# EAGLE design Topshell_V1.2 (EAGLE 7.7.0)
CREVISION: V1.2; DESIGNER: Charlie Costakis
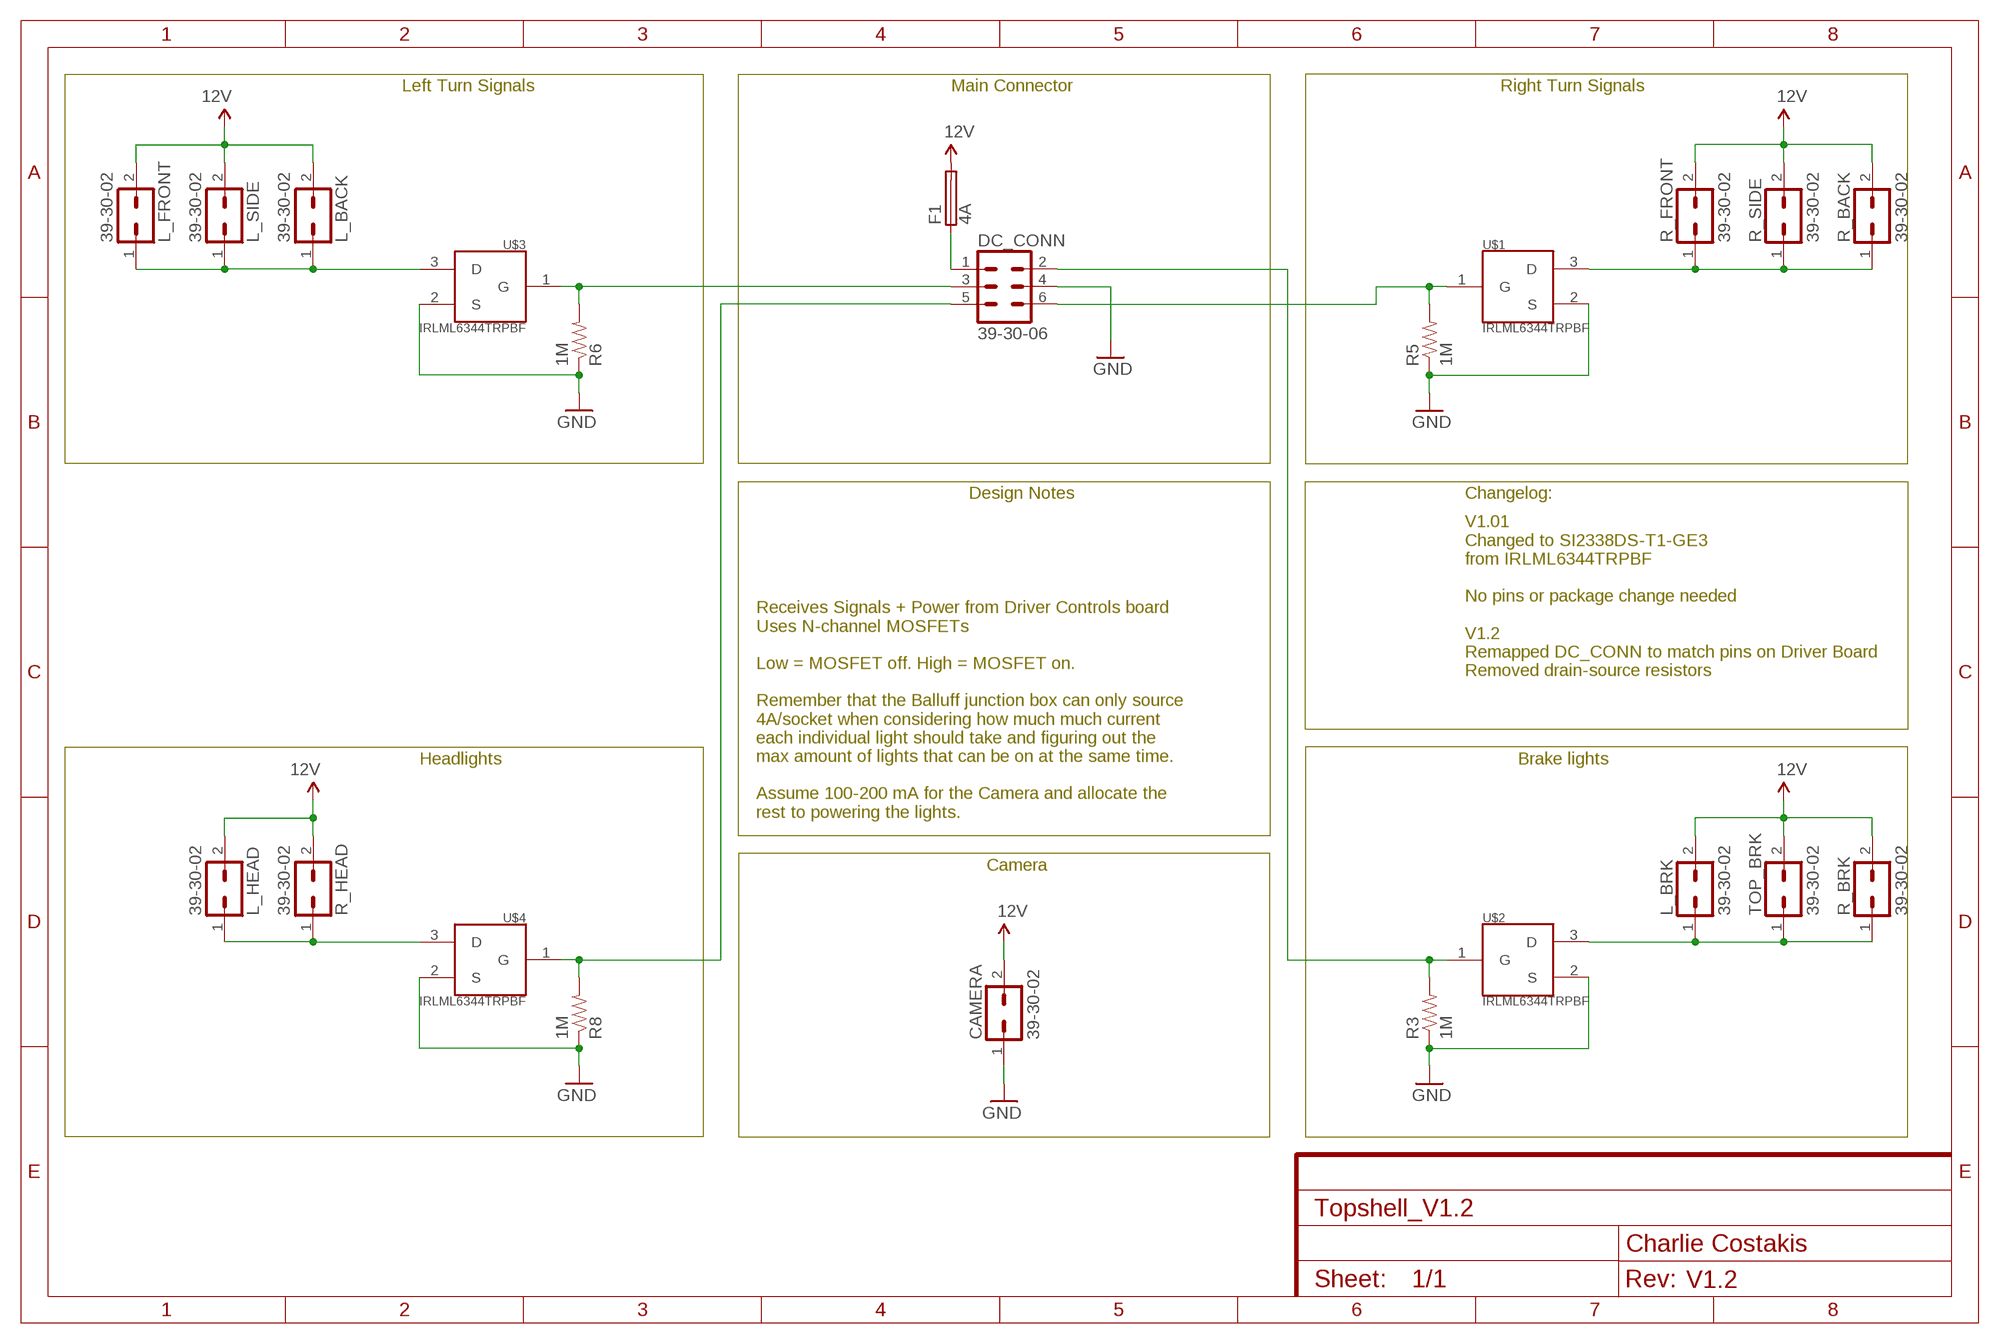
[diagram p0: schematic, sheet 1]

## Parts
CAMERA  39-30-02  [39-30-?02?]
DC_CONN  39-30-06  [39-30-?06?]
F1  4A  SMD-MICRO-FUSE-BLOCK  [OMNIBLOK]
L_BACK  39-30-02  [39-30-?02?]
L_BRK  39-30-02  [39-30-?02?]
L_FRONT  39-30-02  [39-30-?02?]
L_HEAD  39-30-02  [39-30-?02?]
L_SIDE  39-30-02  [39-30-?02?]
R3  1M  RESISTOR0805-RES  [0805]
R5  1M  RESISTOR0805-RES  [0805]
R6  1M  RESISTOR0805-RES  [0805]
R8  1M  RESISTOR0805-RES  [0805]
R_BACK  39-30-02  [39-30-?02?]
R_BRK  39-30-02  [39-30-?02?]
R_FRONT  39-30-02  [39-30-?02?]
R_HEAD  39-30-02  [39-30-?02?]
R_SIDE  39-30-02  [39-30-?02?]
TOP_BRK  39-30-02  [39-30-?02?]
U$1  IRLML6344TRPBF  [SOT23]
U$2  IRLML6344TRPBF  [SOT23]
U$3  IRLML6344TRPBF  [SOT23]
U$4  IRLML6344TRPBF  [SOT23]

## Nets
12V: CAMERA.2 F1.P$2 L_BACK.2 L_BRK.2 L_FRONT.2 L_HEAD.2 L_SIDE.2 R_BACK.2 R_BRK.2 R_FRONT.2 R_HEAD.2 R_SIDE.2 TOP_BRK.2
GND: CAMERA.1 DC_CONN.4 R3.1 R5.1 R6.1 R8.1 U$1.2(S) U$2.2(S) U$3.2(S) U$4.2(S)
N$1: DC_CONN.6 R5.2 U$1.1(G)
N$2: R_BACK.1 R_FRONT.1 R_SIDE.1 U$1.3(D)
N$3: DC_CONN.2 R3.2 U$2.1(G)
N$4: L_BRK.1 R_BRK.1 TOP_BRK.1 U$2.3(D)
N$5: DC_CONN.3 R6.2 U$3.1(G)
N$6: L_BACK.1 L_FRONT.1 L_SIDE.1 U$3.3(D)
N$7: DC_CONN.5 R8.2 U$4.1(G)
N$8: L_HEAD.1 R_HEAD.1 U$4.3(D)
N$14: DC_CONN.1 F1.P$1

## Notes on the sheet
- Left Turn Signals | Main Connector | Right Turn Signals
- Design Notes | Changelog:
- V1.01
  Changed to SI2338DS-T1-GE3
  from IRLML6344TRPBF 
  
  No pins or package change needed
  
  V1.2
  Remapped DC_CONN to match pins on Driver Board
  Removed drain-source resistors
- Headlights | Brake lights
- Receives Signals + Power from Driver Controls board
  Uses N-channel MOSFETs
  
  Low = MOSFET off. High = MOSFET on.
  
  Remember that the Balluff junction box can only source
  4A/socket when considering how much much current
  each individual light should take and figuring out the 
  max amount of lights that can be on at the same time.
  
  Assume 100-200 mA for the Camera and allocate the 
  rest to powering the lights.
- Camera

## Library data of the parts
CAMERA L_BACK L_BRK L_FRONT L_HEAD L_SIDE R_BACK R_BRK R_FRONT R_HEAD R_SIDE TOP_BRK = con-molex-mini-fit:39-30-?02?: HEADER
DC_CONN = con-molex-mini-fit:39-30-?06?: HEADER
F1 = f-lf-omniblok-s:SMD-MICRO-FUSE
R3 R5 R6 R8 = SparkFun-Resistors:RESISTOR: Resistor Basic schematic elements and footprints for 0603, 1206, and PTH resistors.
U$1-U$4 = NUSOLAR_Custom:IRLML6344TRPBF

## Net classes
0 default: clearance 0.205 mm

## Board
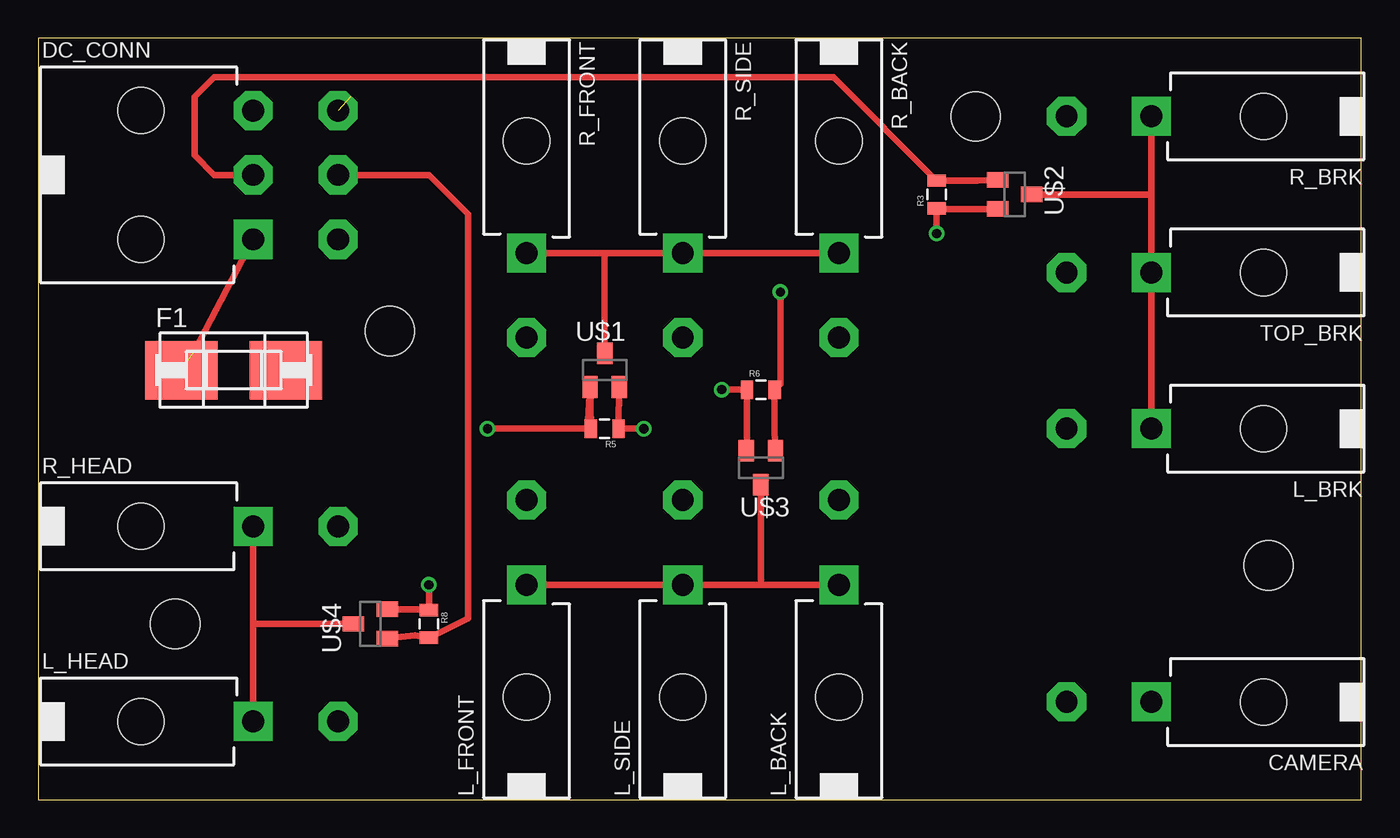
[diagram p1: board, top side]
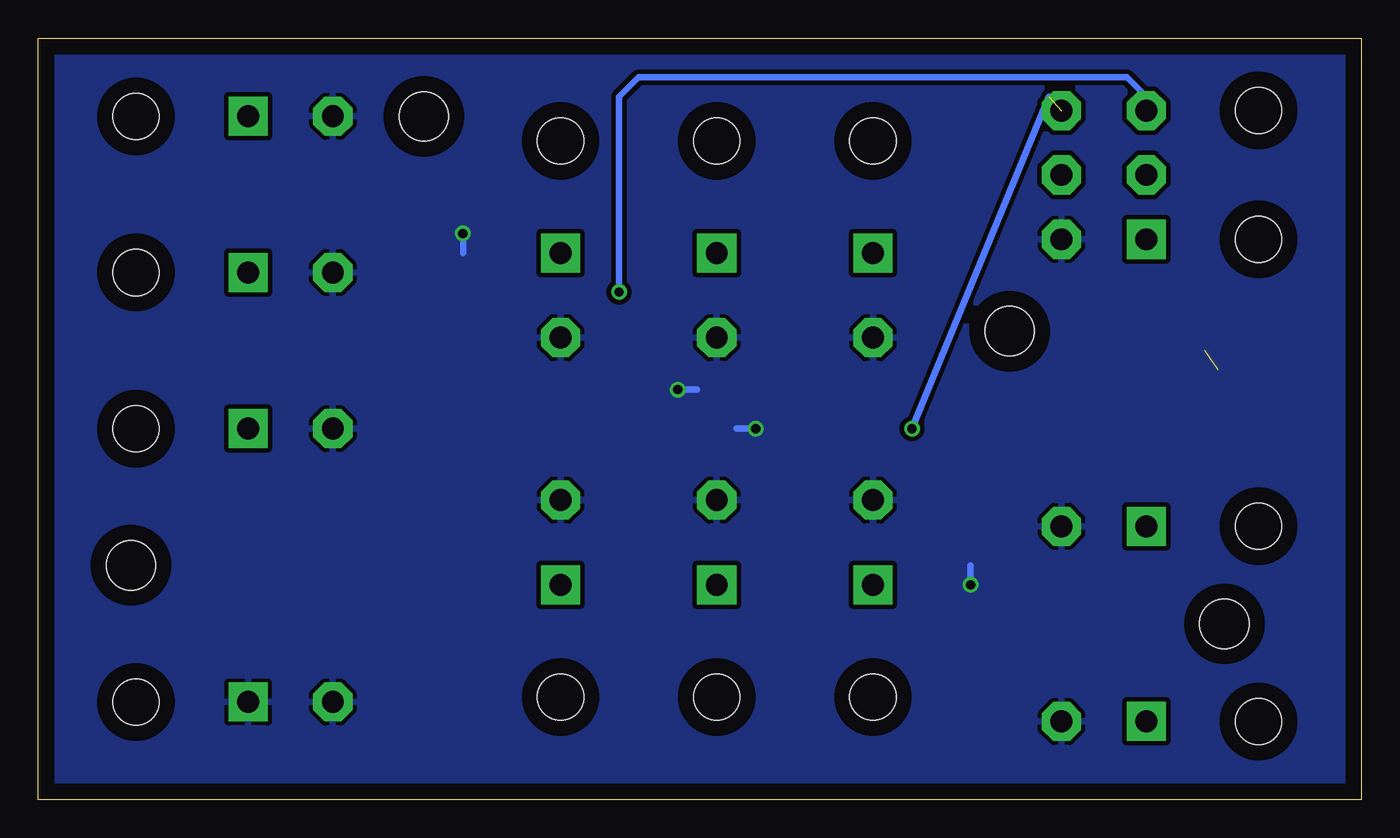
[diagram p2: board, bottom side, seen from below]

Size 86.03 x 49.52 mm. Coordinates in mm from the lower left corner, seen from the top.
Outline: 0,0 86.03,0 86.03,49.52 0,49.52 0,0
Copper layers (1*16): Top 0.035mm / dielectric 1.5mm / Bottom 0.035mm
Design rules "default *": minimum track width 10mil, minimum drill 10mil, track to track 8mil, track to pad 8mil, pad to pad 8mil, via to via 8mil, smd to smd 8mil, copper to edge 40mil, drill to drill 8mil, minimum pad ring 10mil, minimum via ring 8mil, stop-mask expansion 4mil, vias tented up to drill 0mil, thermal gap 10mil
Holes 3.2 mm at 80.01,15.24 8.89,11.43 60.96,44.45 22.86,30.48

### Footprints (pad centres in the part's own frame; a part is rotated, then mirrored left to right if it is on the bottom)
39-30-?02? = drill 1.422 pad 2.54 square: 1 0,0 | drill 1.422 pad 2.54 octagon: 2 0,5.512 | hole 3: 0,-7.3
39-30-?06? = drill 1.422 pad 2.54 square: 1 4.191,0 | drill 1.422 pad 2.54 octagon: 2 0,0; 3 -4.191,0; 4 4.191,5.512; 5 0,5.512; 6 -4.191,5.512 | hole 3: -4.191,-7.3; 4.191,-7.3
OMNIBLOK = smd 4.7 x 3.8: P$1 -3.4,0; P$2 3.4,0
0805 = smd 0.8 x 1.2: 1 -0.9,0; 2 0.9,0
SOT23 = smd 1 x 1.4: 1 -0.95,-1.1; 2 0.95,-1.1; 3 0,1.1

### Placement (x,y rotation side)
CAMERA  39-30-02?  [39-30-?02?]  72.39,6.35 90 top
DC_CONN  39-30-06?  [39-30-?06?]  13.97,40.64 270 top
F1  12.7,27.94 0 top
L_BACK  39-30-02?  [39-30-?02?]  52.07,13.97 0 top
L_BRK  39-30-02?  [39-30-?02?]  72.39,24.13 90 top
L_FRONT  39-30-02?  [39-30-?02?]  31.75,13.97 0 top
L_HEAD  39-30-02?  [39-30-?02?]  13.97,5.08 270 top
L_SIDE  39-30-02?  [39-30-?02?]  41.91,13.97 0 top
R3  58.42,39.37 90 top
R5  36.83,24.13 180 top
R6  46.99,26.67 0 top
R8  25.4,11.43 270 top
R_BACK  39-30-02?  [39-30-?02?]  52.07,35.56 180 top
R_BRK  39-30-02?  [39-30-?02?]  72.39,44.45 90 top
R_FRONT  39-30-02?  [39-30-?02?]  31.75,35.56 180 top
R_HEAD  39-30-02?  [39-30-?02?]  13.97,17.78 270 top
R_SIDE  39-30-02?  [39-30-?02?]  41.91,35.56 180 top
TOP_BRK  39-30-02?  [39-30-?02?]  72.39,34.29 90 top
U$1  36.83,27.94 0 top
U$2  63.5,39.37 270 top
U$3  46.99,21.59 180 top
U$4  21.59,11.43 90 top

### Tracks (layer width: path | path; a pad name or v marks a point on that pad's centre or on a via)
12V
  pour Bottom (isolate 0.305): 0,48.26 85.09,48.26 85.09,1.27 0,1.27
GND  (via drill 0.6)
  Top 0.406: v58.42,36.83 R3.1 58.42,38.42 U$2.2 | v44.45,26.67 R6.1 46.09,22.69 U$3.2 | v39.37,24.13 R5.1 37.73,24.3 U$1.2 | v25.4,13.97 R8.1 25.4,12.38 U$4.2
  Bottom 0.406: v58.42,36.83 58.42,35.56 | v44.45,26.67 43.18,26.67 | v39.37,24.13 40.64,24.13 | v25.4,13.97 25.4,15.24
  pour Bottom (isolate 0.305): 1.27,48.26 85.09,48.26 85.09,1.27 1.27,1.27
N$1  (via drill 0.6)  (1 unrouted)
  Top 0.406: v29.21,24.13 35.71,24.13 U$1.1 35.93,24.3 R5.2 v29.21,24.13
  Bottom 0.406: v29.21,24.13 20.32,45.72
N$2
  Top 0.406: R_BACK.1 R_SIDE.1 36.83,35.56 | R_FRONT.1 36.83,35.56 | U$1.3 36.83,35.56
N$3
  Top 0.406: DC_CONN.2 11.43,40.64 10.16,41.91 10.16,45.72 11.43,46.99 51.7,46.99 R3.2 61.08,40.27 U$2.1
N$4
  Top 0.406: R_BRK.1 72.39,39.37 | 72.39,39.37 TOP_BRK.1 L_BRK.1 | U$2.3 72.39,39.37
N$5  (via drill 0.6)
  Top 0.406: U$3.1 47.89,24.01 R6.2 48.26,27.04 v48.26,33.02
  Bottom 0.406: DC_CONN.3 13.97,45.72 15.24,46.99 46.99,46.99 48.26,45.72 v48.26,33.02
N$6
  Top 0.406: L_FRONT.1 L_SIDE.1 46.99,13.97 | L_BACK.1 46.99,13.97 | U$3.3 46.99,13.97
N$7
  Top 0.406: DC_CONN.5 25.4,40.64 27.94,38.1 27.94,11.8 R8.2 24.5,10.68 U$4.1
N$8
  Top 0.406: L_HEAD.1 13.97,11.43 | 13.97,11.43 R_HEAD.1 | U$4.3 13.97,11.43
N$14  (1 unrouted)
  Top 0.406: DC_CONN.1 10.16,29.21